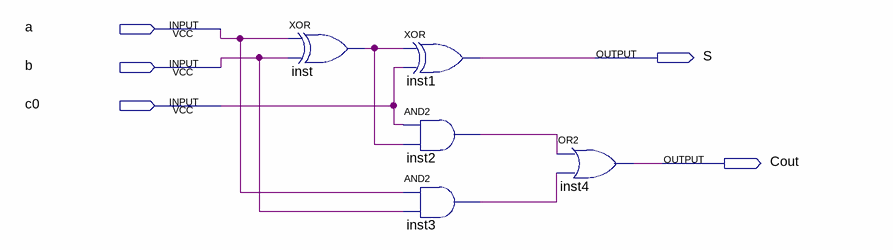
[diagram p0: schematic sheet]
// Quartus schematic FA.bdf as structural Verilog: 5 symbols, 5 pins
module FA (
  input  a,
  input  b,
  input  c0,
  output S,
  output Cout
);

  wire inst2_out, inst3_out, inst_out;

  xor inst (inst_out, a, b);
  xor inst1 (S, inst_out, c0);
  and inst2 (inst2_out, c0, inst_out);
  and inst3 (inst3_out, a, b);
  or inst4 (Cout, inst2_out, inst3_out);
endmodule
